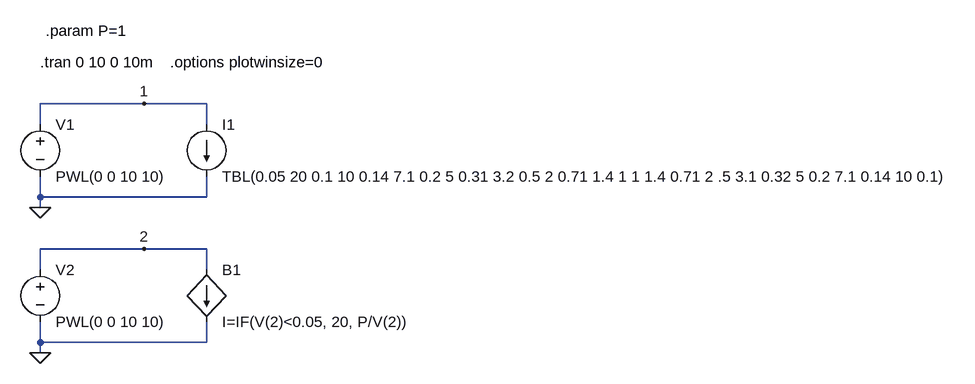
[diagram p0: schematic const_power_load1.asc]
const_power_load1.asc, the LTspice schematic file:
Version 4
SHEET 1 1596 680
WIRE 192 48 32 48
WIRE 288 48 192 48
WIRE 32 80 32 48
WIRE 288 80 288 48
WIRE 32 192 32 160
WIRE 288 192 288 160
WIRE 288 192 32 192
WIRE 32 208 32 192
WIRE 192 272 32 272
WIRE 288 272 192 272
WIRE 32 304 32 272
WIRE 288 304 288 272
WIRE 32 416 32 384
WIRE 288 416 288 384
WIRE 288 416 32 416
WIRE 32 432 32 416
FLAG 32 208 0
FLAG 32 432 0
FLAG 192 48 1
FLAG 192 272 2
SYMBOL voltage 32 64 R0
WINDOW 123 0 0 Left 0
WINDOW 39 0 0 Left 0
SYMATTR InstName V1
SYMATTR Value PWL(0 0 10 10)
SYMBOL load2 288 80 R0
WINDOW 123 0 0 Left 0
WINDOW 39 0 0 Left 0
SYMATTR InstName I1
SYMATTR Value TBL(0.05 20 0.1 10 0.14 7.1 0.2 5 0.31 3.2 0.5 2 0.71 1.4 1 1 1.4 0.71 2 .5 3.1 0.32 5 0.2 7.1 0.14 10 0.1)
SYMBOL voltage 32 288 R0
WINDOW 123 0 0 Left 0
WINDOW 39 0 0 Left 0
SYMATTR InstName V2
SYMATTR Value PWL(0 0 10 10)
SYMBOL bi 288 304 R0
SYMATTR InstName B1
SYMATTR Value I=IF(V(2)<0.05, 20, P/V(2))
TEXT 32 -16 Left 0 !.tran 0 10 0 10m
TEXT 232 -16 Left 0 !.options plotwinsize=0
TEXT 40 -64 Left 0 !.param P=1

The netlist it stands for:
* const_power_load1.asc
V1 1 0 PWL(0 0 10 10)
I1 1 0 TBL(0.05 20 0.1 10 0.14 7.1 0.2 5 0.31 3.2 0.5 2 0.71 1.4 1 1 1.4 0.71 2 .5 3.1 0.32 5 0.2 7.1 0.14 10 0.1)
V2 2 0 PWL(0 0 10 10)
B1 2 0 I=IF(V(2)<0.05, 20, P/V(2))
.tran 0 10 0 10m
.options plotwinsize=0
.param P=1
.backanno
.end